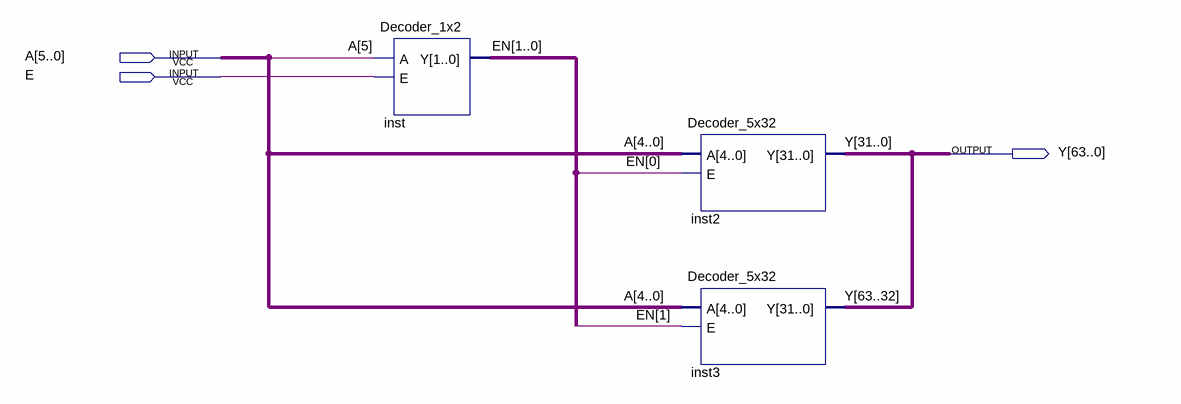
[diagram p0: schematic sheet]
// Quartus schematic Decoder_6x64.bdf as structural Verilog: 3 symbols, 3 pins
module Decoder_6x64 (
  input  [5:0] A,
  input  E,
  output [63:0] Y
);

  wire [1:0] EN;

  Decoder_1x2 inst (.A(A[5]), .E(E), .Y(EN));
  Decoder_5x32 inst2 (.A(A[4:0]), .E(EN[0]), .Y(Y[31:0]));
  Decoder_5x32 inst3 (.A(A[4:0]), .E(EN[1]), .Y(Y[63:32]));
endmodule
